# EAGLE schematic RePhone core 2G-Atmel32u4 v1.0 (EAGLE 6.4)
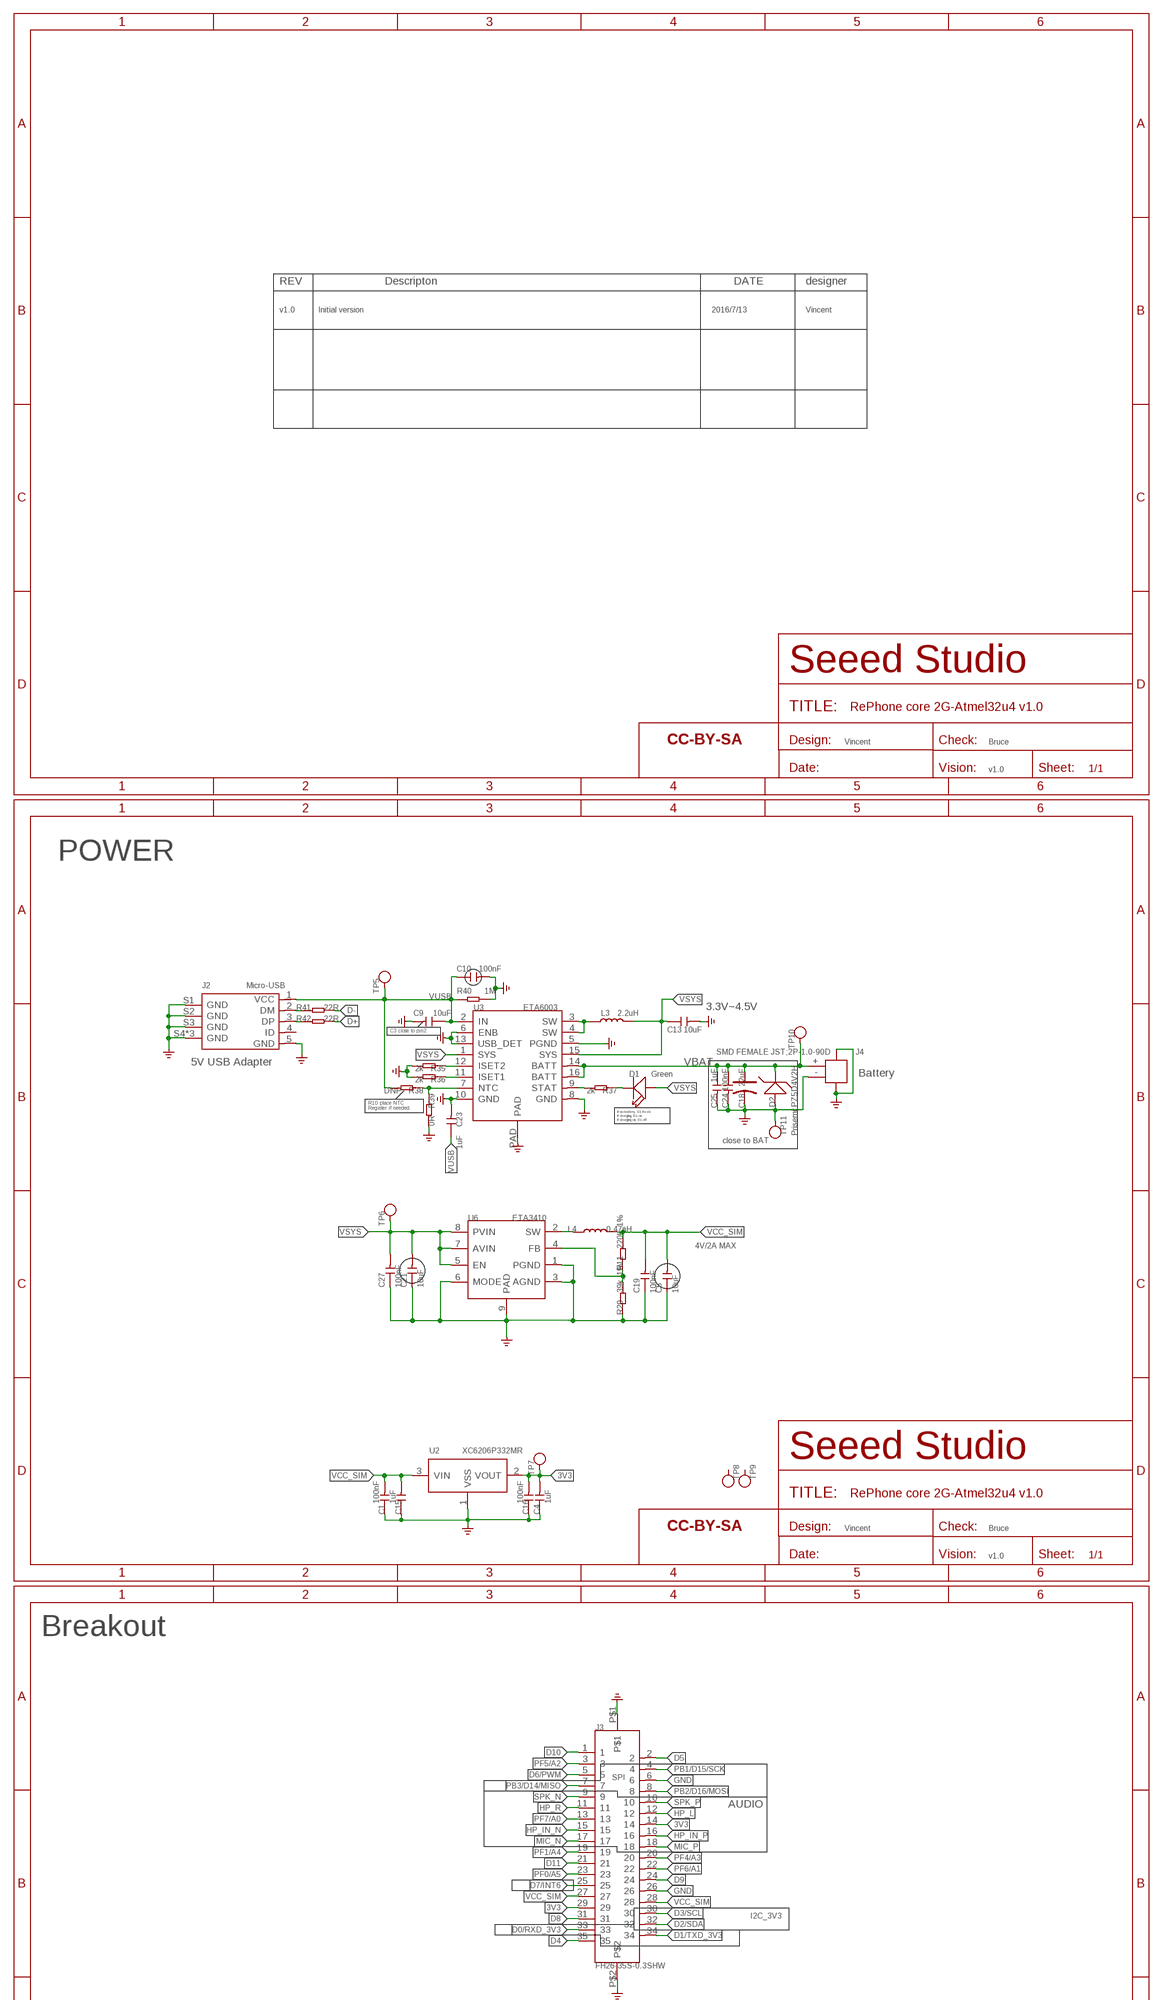
[diagram p0: schematic, sheet 1, part 1 of 2]
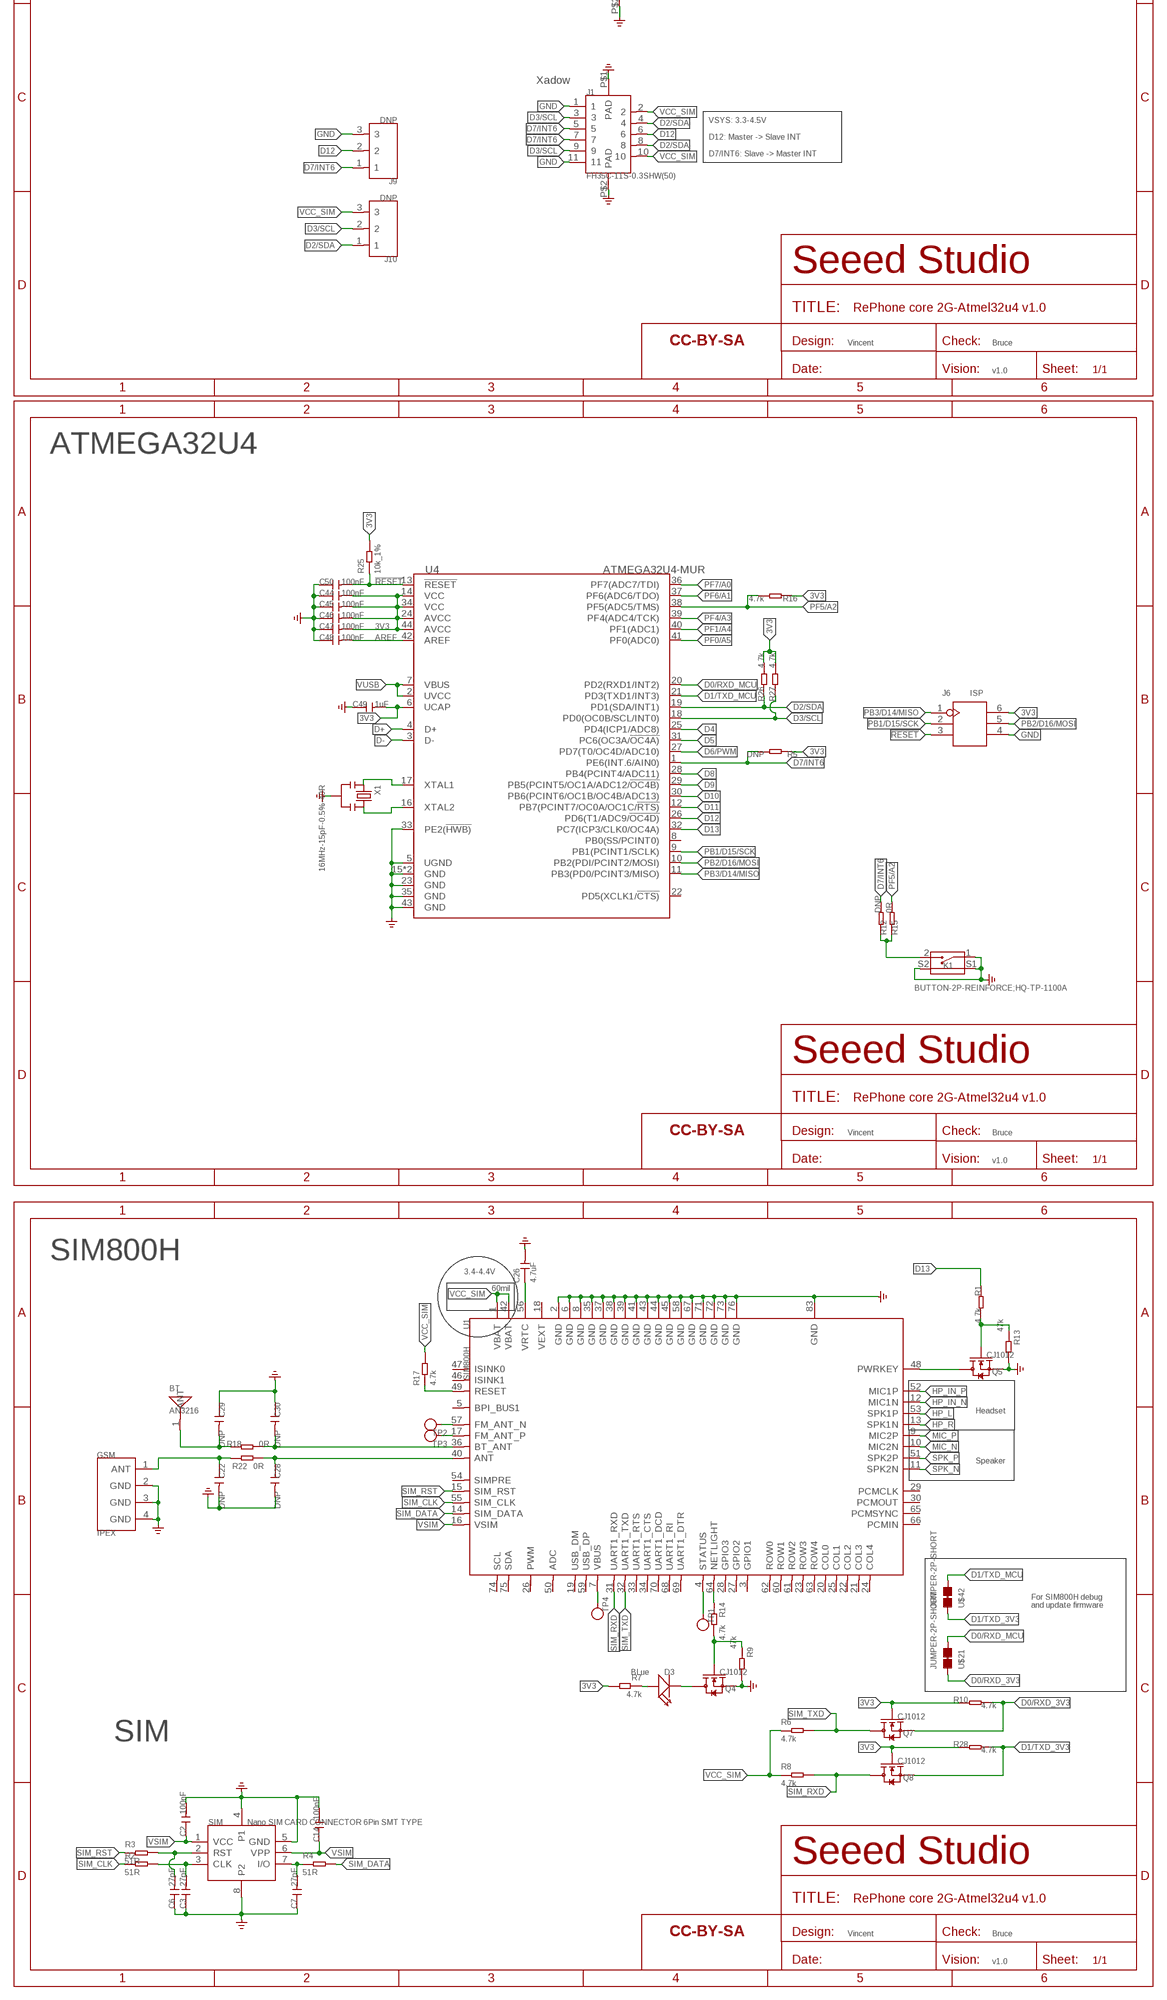
[diagram p1: schematic, sheet 1, part 2 of 2]

## Parts
BT  AN3216  ANTENNA-AN3216  [ANT-SMD2P-3.2X1.6X1.04MM]
C1  100nF  CAP-0201  [C0201]
C2  100nF  CAP-0201  [C0201]
C3  27pF  CAP-0201  [C0201]
C4  1uF  CAP-0402  [C0402]
C5  10uF  CAP-0603  [C0603]
C6  27pF  CAP-0201  [C0201]
C7  27pF  CAP-0201  [C0201]
C9  10uF  CAP-0603  [C0603]
C10  100nF  CAP-0201  [C0201]
C13  10uF  CAP-0603  [C0603]
C14  100nF  CAP-0201  [C0201]
C15  1uF  CAP-0402  [C0402]
C16  100nF  CAP-0201  [C0201]
C18  22uF  CAP-POLAR-AVX-A  [AVX-A]
C19  100nF  CAP-0201  [C0201]
C21  10uF  CAP-0603  [C0603]
C22  DNP  CAP-0201  [C0201]
C23  1uF  CAP-0402  [C0402]
C24  100nF  CAP-0201  [C0201]
C25  1uF  CAP-0402  [C0402]
C26  4.7uF  CAP-0603  [C0603]
C27  100nF  CAP-0201  [C0201]
C28  DNP  CAP-0201  [C0201]
C29  DNP  CAP-0201  [C0201]
C30  DNP  CAP-0201  [C0201]
C44  100nF  CAP-0201  [C0201]
C45  100nF  CAP-0201  [C0201]
C46  100nF  CAP-0201  [C0201]
C47  100nF  CAP-0201  [C0201]
C48  100nF  CAP-0201  [C0201]
C49  1uF  CAP-0402  [C0402]
C50  100nF  CAP-0201  [C0201]
D1  Green  LED-0402  [LED-0402]
D2  Prisemi;PZ5D4V2H  D-ZENER-2P'BZX584CX'  [SOD-523]
D3  BLue  LED-0402  [LED-0402]
FR1  SEEEDSTUDIO-OPEN-SCH-FRAME  [SEEEDSTUDIO-PCB-FRAME]
FR2  SEEEDSTUDIO-OPEN-SCH-FRAME  [SEEEDSTUDIO-PCB-FRAME]
GSM  IPEX  ANT_IPEX  [ANT-IPEX4-1.7X1.7MM]
J1  FH35C-11S-0.3SHW(50)  FPC-CONNECTER-11P(FH35C-11S-0.3SHW(50))  [FPC11-SMD-0.3(FH35C)]
J2  Micro-USB  MICRO-USB5+4P5+4P  [MICRO-USB5+4P-SMD-0.65-B]
J3  FH26-35S-0.3SHW  FPC-CONNECTER-35P(FH26W-35S-0.3SHW(10))  [FPC35-SMD-0.3(FH26W)]
J4  SMD FEMALE JST;2P-1.0-90D  JST-2P-SMD'1.0'  [HW2-SMD-1.0-90D]
J6  ISP  HEADER-2X3P-2.0-1.143  [H2X3-SMD-2.0(1.143)]
J9  DNP  HEADER3  [3P-DIP-2]
J10  DNP  HEADER3  [3P-DIP-2]
K1  BUTTON-2P-REINFORCE;HQ-TP-1100A  BUTTON-2+2P'HQ-TP-1100A'  [SW4-SMD-4.5X3.8X1.8MM-90D]
L3  2.2uH  INDUCTOR/FERRITE-BEAD'0805'  [L0805]
L4  0.47uH  L-MPM201610SR33_T  [L201610]
Q4  CJ1012  MOSFET-N  [SOT-523]
Q5  CJ1012  MOSFET-N  [SOT-523]
Q7  CJ1012  MOSFET-N  [SOT-523]
Q8  CJ1012  MOSFET-N  [SOT-523]
R1  4.7k  RES-0201  [R0201]
R2  51R  RES-0201  [R0201]
R3  51R  RES-0201  [R0201]
R4  51R  RES-0201  [R0201]
R5  DNP  RES-0201  [R0201]
R6  4.7k  RES-0201  [R0201]
R7  4.7k  RES-0201  [R0201]
R8  4.7k  RES-0201  [R0201]
R9  47k  RES-0201  [R0201]
R10  4.7k  RES-0201  [R0201]
R11  220k_1%  RES-0201  [R0201]
R12  DNP  RES-0201  [R0201]
R13  47k  RES-0201  [R0201]
R14  4.7k  RES-0201  [R0201]
R15  0R  RES-0201  [R0201]
R16  4.7k  RES-0201  [R0201]
R17  4.7k  RES-0201  [R0201]
R18  0R  RES-0201  [R0201]
R22  0R  RES-0201  [R0201]
R25  10k_1%  RES-0201  [R0201]
R26  4.7k  RES-0201  [R0201]
R27  4.7k  RES-0201  [R0201]
R28  4.7k  RES-0201  [R0201]
R29  39k_1%  RES-0201  [R0201]
R35  2k  RES-0201  [R0201]
R36  2k  RES-0201  [R0201]
R37  2k  RES-0201  [R0201]
R38  DNP  RES-0201  [R0201]
R39  0R  RES-0201  [R0201]
R40  1M  RES-0201  [R0201]
R41  22R  RES-0201  [R0201]
R42  22R  RES-0201  [R0201]
SIM  Nano SIM CARD CONNECTOR 6Pin SMT TYPE  NANO-SIM-6+2P-SMD  [NANO-SIM6+2P-SMD-12.3X10X1.5MM]
TP1  TEST-POINT-23  [TP-D23MIL]
TP2  TEST-POINT'4545'  [TP-D45MIL]
TP3  TEST-POINT'4545'  [TP-D45MIL]
TP4  TEST-POINT-23  [TP-D23MIL]
TP5  TEST-POINT-23  [TP-D23MIL]
TP6  TEST-POINT-23  [TP-D23MIL]
TP7  TEST-POINT-23  [TP-D23MIL]
TP8  TEST-POINT-23  [TP-D23MIL]
TP9  TEST-POINT-23  [TP-D23MIL]
TP10  TEST-POINT-23  [TP-D23MIL]
TP11  TEST-POINT-23  [TP-D23MIL]
U1  SIM800H  MOUDLE-GPRS-SIM800H  [GPRS88-SMD-1.4-17.8X45.8X2.4MM]
U2  XC6206P332MR  PMIC-XC6206PMR  [SOT-23]
U3  ETA6003  PMIC-ETA6003  [QFN16GA-0.5-3X3MM]
U4  ATMEGA32U4-MUR  MCU-ATMEGA32U4-MUR  [QFN44G-0.5-7X7MM]
U6  ETA3410  CONVERTER-ETA3410  [DFN8G-0.5-2X2MM]
U$1  SEEEDSTUDIO-OPEN-SCH-FRAME  [SEEEDSTUDIO-PCB-FRAME]
U$3  SEEEDSTUDIO-OPEN-SCH-FRAME  [SEEEDSTUDIO-PCB-FRAME]
U$5  SEEEDSTUDIO-OPEN-SCH-FRAME  [SEEEDSTUDIO-PCB-FRAME]
U$21  JUMPER-2P-SHORT  [2P-SMD-SHORT]
U$42  JUMPER-2P-SHORT  [2P-SMD-SHORT]
X1  16MHz-15pF-0.5%-40R  CRYSTAL-RESONATOR'SMD'  [RESONATOR3-SMD-3.6X1.3X0.8MM]

## Nets
3V3: C4.2 C16.2 C44.2 C45.2 C46.2 C47.2 C49.2 J3.14 J3.29 J6.6 Q7.1(G) Q8.1(G) R5.1 R7.2 R10.1 R16.1 R25.2 R26.2 R27.2 R28.1 TP7.T U2.2(VOUT) U4.6(UCAP) U4.14(VCC) U4.24(AVCC) U4.34(VCC) U4.44(AVCC)
!RESET: C50.2 J6.3 R25.1 U4.13(!RESET)
AREF: C48.2 U4.42(AREF)
D0/RXD_3V3: J3.33 Q7.2(S) R10.2 U$21.1
D0/RXD_MCU: U4.20(PD2(RXD1/INT2)) U$21.2
D1/TXD_3V3: J3.34 Q8.2(S) R28.2 U$42.1
D1/TXD_MCU: U4.21(PD3(TXD1/INT3)) U$42.2
D2/SDA: J1.4 J1.8 J3.32 J10.1 R26.1 U4.19(PD1(SDA/INT1))
D3/SCL: J1.3 J1.9 J3.30 J10.2 R27.1 U4.18(PD0(OC0B/SCL/INT0))
D4: J3.35 U4.25(PD4(ICP1/ADC8))
D5: J3.2 U4.31(PC6(OC3A/!OC4A))
D6/PWM: J3.5 U4.27(PD7(T0/OC4D/ADC10))
D7/INT6: J1.5 J1.7 J3.25 J9.1 R5.2 R12.2 U4.1(PE6(INT.6/AIN0))
D8: J3.31 U4.28(PB4(PCINT4/ADC11))
D9: J3.24 U4.29(PB5(PCINT5/OC1A/ADC12/!OC4B))
D10: J3.1 U4.30(PB6(PCINT6/OC1B/OC4B/ADC13))
D11: J3.21 U4.12(PB7(PCINT7/OC0A/OC1C/!RTS))
D12: J1.6 J9.2 U4.26(PD6(T1/ADC9/!OC4D))
D13: R1.1 U4.32(PC7(ICP3/CLK0/OC4A))
D+: R42.2 U4.4(D+)
D-: R41.2 U4.3(D-)
GND: C1.1 C2.2 C3.1 C4.1 C5.1 C6.1 C7.1 C9.2 C10.2 C13.2 C14.2 C15.1 C16.1 C18.- C19.1 C21.1 C22.2 C23.2 C24.2 C25.2 C26.2 C27.1 C28.2 C29.1 C30.1 C44.1 C45.1 C46.1 C47.1 C48.1 C49.1 C50.1 D2.+ GSM.2(GND) GSM.3(GND) GSM.4(GND) J1.1 J1.11 J1.P$1(PAD) J1.P$2(PAD) J2.5(GND) J2.S1(GND) J2.S2(GND) J2.S3(GND) J2.S4(GND) J2.S5(GND) J2.S6(GND) J3.6 J3.26 J3.P$1 J3.P$2 J4.3 J4.4 J4.- J6.4 J9.3 K1.1 K1.S1 K1.S2 Q4.2(S) Q5.2(S) R9.2 R13.2 R29.1 R35.2 R36.2 R39.2 R40.2 SIM.4(P1) SIM.5(GND) SIM.8(P2) TP11.T U1.2(GND) U1.6(GND) U1.8(GND) U1.35(GND) U1.37(GND) U1.38(GND) U1.39(GND) U1.41(GND) U1.43(GND) U1.44(GND) U1.45(GND) U1.58(GND) U1.67(GND) U1.71(GND) U1.72(GND) U1.73(GND) U1.76(GND) U1.83(GND) U2.1(VSS) U3.5(PGND) U3.6(ENB) U3.8(GND) U3.10(GND) U3.13(USB_DET) U3.PAD U4.5(UGND) U4.15(GND) U4.23(GND) U4.33(PE2(!HWB)) U4.35(GND) U4.43(GND) U4.TAB(GND) U6.1(PGND) U6.3(AGND) U6.6(MODE) U6.9(PAD) X1.2 ; supply symbol labelled GND_POWER
HP_IN_N: J3.15 U1.12(MIC1N)
HP_IN_P: J3.16 U1.52(MIC1P)
HP_L: J3.12 U1.53(SPK1P)
HP_R: J3.11 U1.13(SPK1N)
MIC_N: J3.17 U1.10(MIC2N)
MIC_P: J3.18 U1.9(MIC2P)
N$1: L4.1 U6.2(SW)
N$2: U4.17(XTAL1) X1.1
N$3: Q5.3(D) U1.48(PWRKEY)
N$4: R11.1 R29.2 U6.4(FB)
N$5: TP4.T U1.7(VBUS)
N$6: C26.1 U1.56(VRTC)
N$8: TP2.T U1.57(FM_ANT_N)
N$9: TP3.T U1.17(FM_ANT_P)
N$10: C3.2 R2.2 SIM.3(CLK)
N$12: C6.2 R3.2 SIM.2(RST)
N$18: Q4.1(G) R9.1 R14.2
N$19: R35.1 U3.12(ISET2)
N$20: D3.+ R7.1
N$21: D3.- Q4.3(D)
N$22: R36.1 U3.11(ISET1)
N$23: L3.1 U3.3(SW) U3.4(SW)
N$24: R37.2 U3.9(STAT)
N$25: D1.- R37.1
N$31: R38.1 R39.1 U3.7(NTC)
N$32: R14.1 U1.64(NETLIGHT)
N$33: R17.1 U1.49(RESET)
N$34: Q5.1(G) R1.2 R13.1
N$35: J2.2(DM) R41.1
N$36: J2.3(DP) R42.1
N$37: U4.16(XTAL2) X1.3
N$38: TP1.T U1.4(STATUS)
N$39: BT.1(ANT) C29.2 R18.2
N$40: C22.1 GSM.1(ANT) R22.2
N$41: C28.1 R22.1 U1.40(ANT)
N$42: C30.2 R18.1 U1.36(BT_ANT)
N$43: C7.2 R4.1 SIM.7(I/O)
N$45: K1.2 R12.1 R15.1
PB1/D15/SCK: J3.4 J6.2 U4.9(PB1(PCINT1/SCLK))
PB2/D16/MOSI: J3.8 J6.5 U4.10(PB2(PDI/PCINT2/MOSI))
PB3/D14/MISO: J3.7 J6.1 U4.11(PB3(PD0/PCINT3/MISO))
PF0/A5: J3.23 U4.41(PF0(ADC0))
PF1/A4: J3.19 U4.40(PF1(ADC1))
PF4/A3: J3.20 U4.39(PF4(ADC4/TCK))
PF5/A2: J3.3 R15.2 R16.2 U4.38(PF5(ADC5/TMS))
PF6/A1: J3.22 U4.37(PF6(ADC6/TDO))
PF7/A0: J3.13 U4.36(PF7(ADC7/TDI))
SIM_CLK: R2.1 U1.55(SIM_CLK)
SIM_DATA: R4.2 U1.14(SIM_DATA)
SIM_RST: R3.1 U1.15(SIM_RST)
SIM_RXD: Q8.3(D) R8.2 U1.31(UART1_RXD)
SIM_TXD: Q7.3(D) R6.2 U1.32(UART1_TXD)
SPK_N: J3.9 U1.11(SPK2N)
SPK_P: J3.10 U1.51(SPK2P)
VBAT: C18.+ C24.1 C25.1 D2.- J4.+ TP10.T U3.14(BATT) U3.16(BATT)
VCC_SIM: C1.2 C5.2 C15.2 C19.2 J1.2 J1.10 J3.27 J3.28 J10.3 L4.2 R6.1 R8.1 R11.2 R17.2 U1.1(VBAT) U1.42(VBAT) U2.3(VIN)
VSIM: C2.1 C14.1 SIM.1(VCC) SIM.6(VPP) U1.16(VSIM)
VSYS: C13.1 C21.2 C27.2 D1.+ L3.2 TP6.T U3.1(SYS) U3.15(SYS) U6.5(EN) U6.7(AVIN) U6.8(PVIN)
VUSB: C9.1 C10.1 C23.1 J2.1(VCC) R38.2 R40.1 TP5.T U3.2(IN) U4.2(UVCC) U4.7(VBUS)
Unconnected: J2.4(ID) TP8.T TP9.T U1.3(GPIO1) U1.5(BPI_BUS1) U1.18(VEXT) U1.19(USB_DM) U1.20(COL0) U1.21(COL3) U1.22(COL2) U1.23(ROW3) U1.24(COL4) U1.25(COL1) U1.26(PWM) U1.27(GPIO2) U1.28(GPIO3) U1.29(PCMCLK) U1.30(PCMOUT) U1.33(UART1_RTS) U1.34(UART1_CTS) U1.46(ISINK1) U1.47(ISINK0) U1.50(ADC) U1.54(SIMPRE) U1.59(USB_DP) U1.60(ROW1) U1.61(ROW2) U1.62(ROW0) U1.63(ROW4) U1.65(PCMSYNC) U1.66(PCMIN) U1.68(UART1_RI) U1.69(UART1_DTR) U1.70(UART1_DCD) U1.74(SCL) U1.75(SDA) U4.8(PB0(SS/PCINT0)) U4.22(PD5(XCLK1/!CTS))

## Notes on the sheet
- REV | Descripton | DATE | designer
- v1.0 | Initial version | 2016/7/13 | Vincent
- Vincent | Bruce
- v1.0
- POWER
- 3.3V~4.5V
- C3 close to pin2
- 5V USB Adapter
- Battery
- R10 place NTC 
  Register if needed.
- if no battery, D1 flash.
  if charging, D1 on.
  if charging ok, D1 off.
- close to BAT
- 4V/2A MAX
- Vincent | Bruce
- v1.0
- Breakout
- SPI
- AUDIO
- I2C_3V3
- Xadow
- VSYS: 3.3-4.5V
- D12: Master -> Slave INT
- D7/INT6: Slave -> Master INT
- Vincent | Bruce
- v1.0
- ATMEGA32U4
- Vincent | Bruce
- v1.0
- SIM800H
- 3.4-4.4V
- 60mil
- Headset
- Speaker
- For SIM800H debug
  and update firmware
- SIM
- Vincent | Bruce
- v1.0

## Library data of the parts
BT = template:ANTENNA-AN3216
C1-C7 C9 C10 C13-C16 C19 C21-C30 C44-C50 = Discrete-new:CAP: Ceramic Capacitors
C18 = Discrete-new:CAP-POLAR: Electrolytic Capacitors,Tantalum Capacitors and Super Capacitors
D1 D3 = Discrete-new:LED
D2 = Discrete-new:D-ZENER-2P: SOD-123:304030008;SOT-23:304030000
FR1 FR2 U$1 U$3 U$5 = moudle-new:SEEEDSTUDIO-OPEN-SCH-FRAME
GSM = template:ANT_IPEX
J1 = template:FPC-CONNECTER-11P(FH35C-11S-0.3SHW(50))
J2 = Connector-new:MICRO-USB5+4P: 5+4P-SMD-0.65-B:320010000;5+2P-SMD-0.65-AB:340032001
J3 = template:FPC-CONNECTER-35P(FH26W-35S-0.3SHW(10))
J4 = Connector-new:JST-2P-SMD: 2P-SMD-1.0-90D:320110054;2P-SMD-2.0-90D:320110026
J6 = Connector-new:HEADER-2X3P
J9 J10 = template:HEADER3
K1 = Discrete-new:BUTTON-2+2P: SW4-SMD-4.5X3.8X1.8MM-90D:311020035;SW4-SMD-7.0X3.5X3.5MM-90D:311020023
L3 = Discrete-new:INDUCTOR/FERRITE-BEAD
L4 = Discrete-new:L
Q4 Q5 Q7 Q8 = template:MOSFET-N: IRLL014: http://www.vishay.com/docs/91319/sihll014.pdf
R1-R18 R22 R25-R29 R35-R42 = Discrete-new:RES
SIM = template:NANO-SIM-6+2P-SMD
TP1 TP4-TP11 = Discrete-new:TEST-POINT
TP2 TP3 = Discrete-new:TEST-POINT; PARTNO: DNP
U1 = moudle-new:MOUDLE-GPRS-SIM800H
U2 = IC-new:PMIC-XC6206P: LOW ESR Cap.Compatible Positive Voltage Regulators
U3 = template:PMIC-ETA6003: 310990023
U4 = IC-new:MCU-ATMEGA32U4: TQFP-44:310010010;VQFN-44:310010016
U6 = template:CONVERTER-ETA3410: 3MHZ 2A High Step-Down Converter in DFN2x2-8L Package
U$21 U$42 = Discrete-new:JUMPER-2P-SHORT
X1 = Discrete-new:CRYSTAL-RESONATOR: Resonator Small SMD resonator. This is the itty bitty 10/20MHz resonators with built in caps. CSTCE10M0G55 and CSTCE20M0V53. Footprint has been reviewed closely but hasn't been tested yet.